# Altium schematic sheet Sheet1.SchDoc
size A4
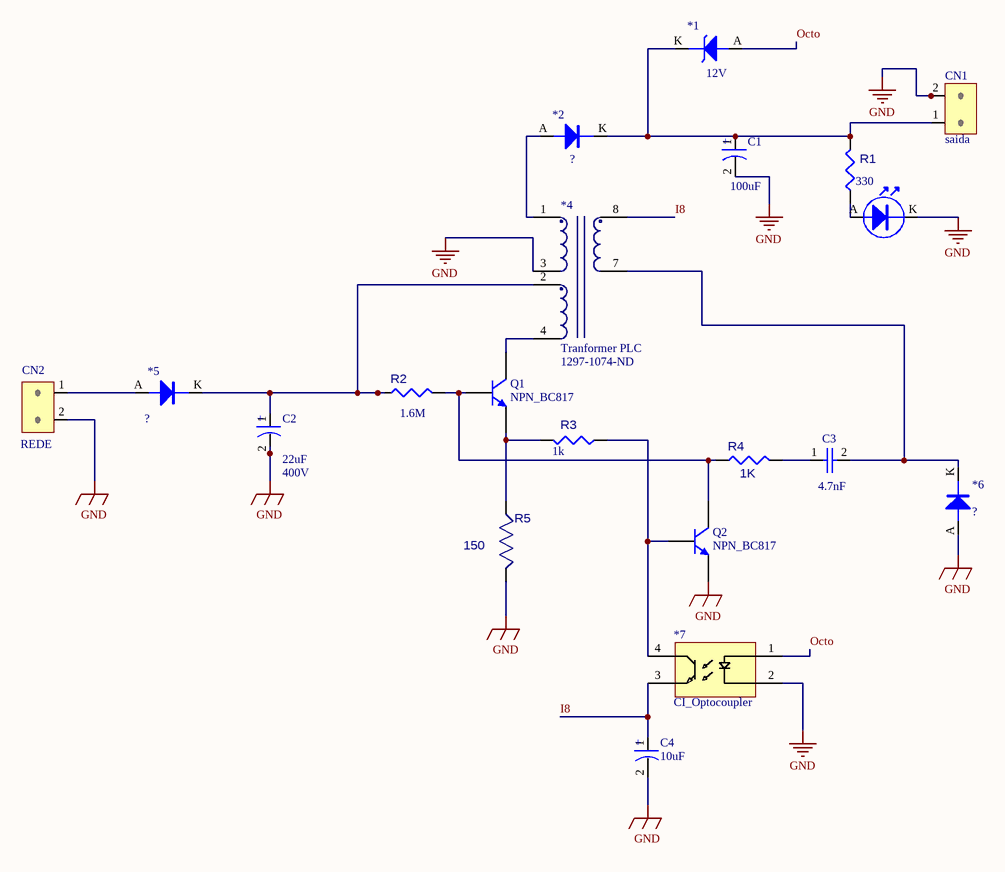
[diagram p0: Sheet1.SchDoc]

## Parts
*1  value 12V  [DIO_PTH_DO35]  (hidden comment: DIO_ZENER_DO35)
*2  DIO_PTH_1N4007  [DIO_PTH_DO41]  (value not drawn)
*3  LED_AXIAL_5MM  [LED_Axial_5mm]  (value not drawn)
*4  Tranformer PLC  Supplier Part Number 1: 1297-1074-ND  [DIV_TRAFO PLC]
*5  DIO_SMD_1N4148  [DIO_SMD_SOD323]  (value not drawn)
*6  DIO_PTH_1N4007  [DIO_PTH_DO41]  (value not drawn)
*7  CI_Optocoupler  [SFH6106]
C1  value 100uF  [CAP_ALU_RADIAL_5MM]  (hidden comment: Electrolytic Capacitor)
C2  value 22uF  Tensão: 400V  [CAP_ALU_RADIAL_5MM]  (hidden comment: Electrolytic Capacitor)
C3  value 4.7nF  [CAP_POL_RADIAL_16MM]  (hidden comment: CAP_POL_RADIAL_16MM)
C4  10uF  [CAP_ALU_RADIAL_5MM]
CN1  saida  [CN_KRE_2]
CN2  Footprint: REDE  [CN_KRE_2]  (hidden comment: ?)
Q1  NPN_BC817  [HEADER_1X3]
Q2  NPN_BC817  [HEADER_1X3]
R1  330  [RES_PTH_7.62MM]
R2  1.6M  [RES_PTH_7.62MM]
R3  1k  [RES_PTH_7.62MM]
R4  Footprint: 1K  [RES_PTH_7.62MM]  (hidden comment: ?)
R5  Footprint: 150  [RES-7.62mm]  (hidden comment: *)

## Nets
GND: *3.K *4.3 *6.A *7.2(C) C1.2 C2.2 C4.2 CN1.2 CN2.2 Q2.2(E) R5.2
I8: *4.8 *7.3(C) C4.1
Octo: *1.A *7.1(A)
Net*1_K: *1.K *2.K C1.1 CN1.1 R1.2
Net*2_A: *2.A *4.1
Net*3_A: *3.A R1.1
Net*4_2: *4.2 *5.K C2.1 R2.1
Net*4_4: *4.4 Q1.3(C)
Net*4_7: *4.7 *6.K C3.2
Net*5_A: *5.A CN2.1
Net*7_4: *7.4(E) Q2.1(B) R3.1
NetC3_1: C3.1 R4.2
NetQ1_1: Q1.1(B) Q2.3(C) R2.2 R4.1
NetQ1_2: Q1.2(E) R3.2 R5.1

## Notes on the sheet
- (in symbol CAP_ALU_RADIAL_5MM) +

## Library data of the parts
C1 C2 = CAP_ALU_RADIAL_5MM: PTH Radial Electrolytic Capacitor
  C1: Tensão: ?
C3 = CAP_POL_RADIAL_16MM: PTH Radial Polyester Capacitor; Tensão: ?
C4 = CAP_ALU_RADIAL_5MM: PTH Radial Electrolytic Capacitor; Value: ?F; Tensão: ?
CN1 CN2 = CN_MKDS_2: MKDS_2; Value: ?
R1-R4 = RES_PTH_7.62MM: Pin Through Hole Resistor 7.62mm
  R1: Value: 330
  R2: Value: 1.6M
  R3: Value: 1k
  R4: Value: ?
R5 = RES_PTH300: Pin Through Hole Resistor 300mils/7.62mm; Value: *
*2 *6 = DIO_PTH_1N4007: Value: ?
*3 = LED_AXIAL_5MM: Value: ?
*4 = Tranformer PLC: Supplier 1: Digi-Key
*5 = DIO_SMD_1N4148: Value: ?